# Altium project Dr_0n.PrjPcb
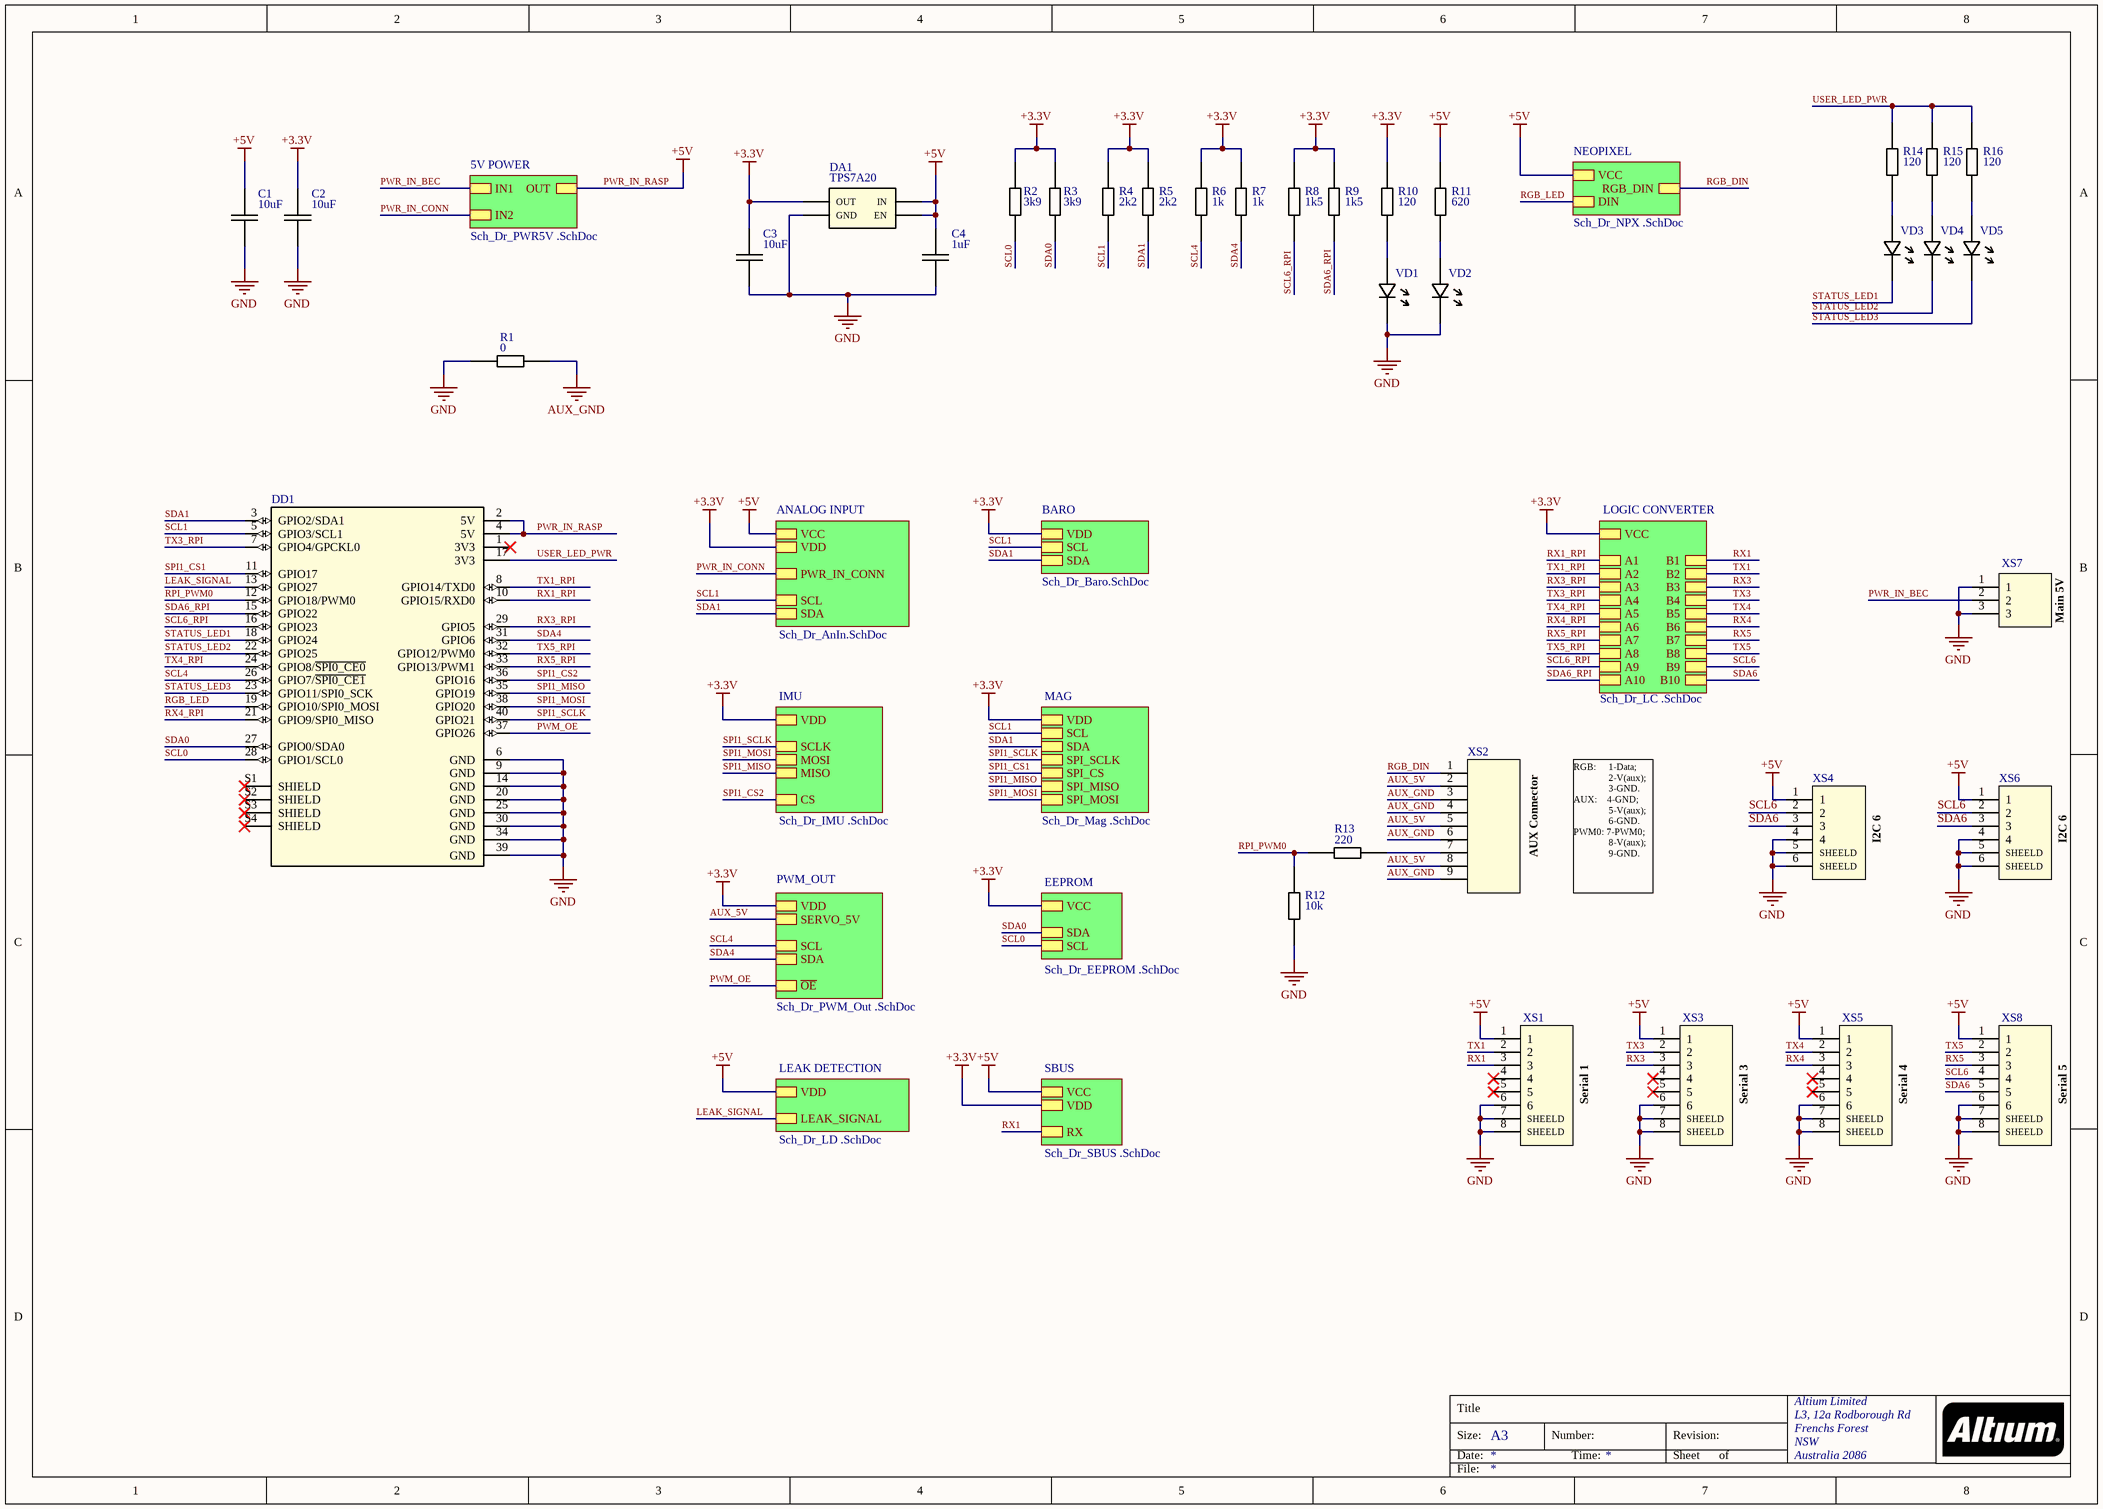
[diagram p0: Sch_Dr_General.SchDoc]
12 sheets, 162 parts. Net scope: hierarchical (ports join the sheet entries above them; power ports are global).
Board file: Dr_0n.PcbDoc
Sheets:
  Sch_Dr_General.SchDoc
    5V POWER = Sch_Dr_PWR5V .SchDoc
    BARO = Sch_Dr_Baro.SchDoc
    NEOPIXEL = Sch_Dr_NPX .SchDoc
    ANALOG INPUT = Sch_Dr_AnIn.SchDoc
    IMU = Sch_Dr_IMU .SchDoc
    MAG = Sch_Dr_Mag .SchDoc
    PWM_OUT = Sch_Dr_PWM_Out .SchDoc
    LEAK DETECTION = Sch_Dr_LD .SchDoc
    EEPROM = Sch_Dr_EEPROM .SchDoc
    SBUS = Sch_Dr_SBUS .SchDoc
    LOGIC CONVERTER = Sch_Dr_LC .SchDoc

## Sheet Sch_Dr_General.SchDoc
size A3; Organization: Altium Limited; Address1: L3, 12a Rodborough Rd; Address2: Frenchs Forest; Address3: NSW; Address4: Australia 2086

### Parts
C1  10uF  [Cap_0603]
C2  10uF  [Cap_0603]
C3  10uF  [Cap_0603]
C4  1uF  [Cap_0603]
DA1  TPS7A20  [SOT-23-5]
DD1  RASPBERRY_PI_4  [MOD_RASPBERRY_PI_4B_4GB]  (value not drawn)
R1  0  [Res_0603]
R2  3k9  [Res_0603]
R3  3k9  [Res_0603]
R4  2k2  [Res_0603]
R5  2k2  [Res_0603]
R6  1k  [Res_0603]
R7  1k  [Res_0603]
R8  1k5  [Res_0603]
R9  1k5  [Res_0603]
R10  120  [Res_0603]
R11  620  [Res_0603]
R12  10k  [Res_0603]
R13  220  [Res_0603]
R14  120  [Res_0603]
R15  120  [Res_0603]
R16  120  [Res_0603]
VD1  TO-1608BC-PG  [0603_LED]  (value not drawn)
VD2  TO-1608BC-PG  [0603_LED]  (value not drawn)
VD3  TO-1608BC-PG  [0603_LED]  (value not drawn)
VD4  TO-1608BC-PG  [0603_LED]  (value not drawn)
VD5  TO-1608BC-PG  [0603_LED]  (value not drawn)
XS1  BM06B-GHS-TBT(LF)(SN)(N)  [BM06B-GHS-TBT]  (value not drawn)
XS2  PLS-9  [AUX_CON]  (value not drawn)
XS3  BM06B-GHS-TBT(LF)(SN)(N)  [BM06B-GHS-TBT]  (value not drawn)
XS4  BM04B-GHS-TBT(LF)(SN)(N)  [BM04B-GHS-TBT]  (value not drawn)
XS5  BM06B-GHS-TBT(LF)(SN)(N)  [BM06B-GHS-TBT]  (value not drawn)
XS6  BM04B-GHS-TBT(LF)(SN)(N)  [BM04B-GHS-TBT]  (value not drawn)
XS7  PLS-3  [3X]  (value not drawn)
XS8  BM06B-GHS-TBT(LF)(SN)(N)  [BM06B-GHS-TBT]  (value not drawn)

### Sub-sheets
5V POWER = Sch_Dr_PWR5V .SchDoc: OUT, IN2, IN1
ANALOG INPUT = Sch_Dr_AnIn.SchDoc: VCC, VDD, PWR_IN_CONN, SCL, SDA
BARO = Sch_Dr_Baro.SchDoc: VDD, SCL, SDA
EEPROM = Sch_Dr_EEPROM .SchDoc: VCC, SDA, SCL
IMU = Sch_Dr_IMU .SchDoc: VDD, SCLK, MOSI, MISO, CS
LEAK DETECTION = Sch_Dr_LD .SchDoc: VDD, LEAK_SIGNAL
LOGIC CONVERTER = Sch_Dr_LC .SchDoc: A1, A2, A3, A4, A5, A6, A7, A8, A9, A10, B1, B2, B3, B4, B5, B6, B7, B8, B9, B10, VCC
MAG = Sch_Dr_Mag .SchDoc: VDD, SCL, SDA, SPI_SCLK, SPI_CS, SPI_MISO, SPI_MOSI
NEOPIXEL = Sch_Dr_NPX .SchDoc: VCC, DIN, RGB_DIN
PWM_OUT = Sch_Dr_PWM_Out .SchDoc: SERVO_5V, SCL, SDA, ~{OE}, VDD
SBUS = Sch_Dr_SBUS .SchDoc: VCC, VDD, RX

### Nets
+3.3V: C2.2 C3.2 DA1.5(OUT) R2.2 R3.2 R4.1 R5.1 R6.1 R7.1 R8.1 R9.1 R10.1 ; sheet BARO/VDD, sheet ANALOG INPUT/VDD, sheet IMU/VDD, sheet MAG/VDD, sheet PWM_OUT/VDD, sheet EEPROM/VCC, sheet SBUS/VDD, sheet LOGIC CONVERTER/VCC  [project net VCC]
AUX_GND: R1.2 XS2.3 XS2.4 XS2.6 XS2.9
GND: C1.1 C2.1 C3.1 C4.1 DA1.2(GND) DD1.6(GND) DD1.9(GND) DD1.14(GND) DD1.20(GND) DD1.25(GND) DD1.30(GND) DD1.34(GND) DD1.39(GND) R1.1 R12.2 VD1.1(K) VD2.1(K) XS1.6 XS1.7(SHEELD) XS1.8(SHEELD) XS3.6 XS3.7(SHEELD) XS3.8(SHEELD) XS4.4 XS4.5(SHEELD) XS4.6(SHEELD) XS5.6 XS5.7(SHEELD) XS5.8(SHEELD) XS6.4 XS6.5(SHEELD) XS6.6(SHEELD) XS7.1 XS7.3 XS8.6 XS8.7(SHEELD) XS8.8(SHEELD)
PWR_IN_RASP: C1.2 C4.2 DA1.1(IN) DA1.3(EN) DD1.2(5V) DD1.4(5V) R11.1 XS1.1 XS3.1 XS4.1 XS5.1 XS6.1 XS8.1 ; sheet 5V POWER/OUT, sheet NEOPIXEL/VCC, sheet ANALOG INPUT/VCC, sheet LEAK DETECTION/VDD, sheet SBUS/VCC  [also labelled +5V]
AUX_5V: XS2.2 XS2.5 XS2.8 ; sheet PWM_OUT/SERVO_5V
LEAK_SIGNAL: DD1.13(GPIO27) ; sheet LEAK DETECTION/LEAK_SIGNAL
PWM_OE: DD1.37(GPIO26) ; sheet PWM_OUT/~{OE}
PWR_IN_BEC: XS7.2 ; sheet 5V POWER/IN1  [project net IN1]
PWR_IN_CONN: sheet 5V POWER/IN2, sheet ANALOG INPUT/PWR_IN_CONN  [project net IN2]
RGB_DIN: XS2.1 ; sheet NEOPIXEL/RGB_DIN
RGB_LED: DD1.19(GPIO10/SPI0_MOSI) ; sheet NEOPIXEL/DIN
RPI_PWM0: DD1.12(GPIO18/PWM0) R12.1 R13.1
RX1: XS1.3 ; sheet SBUS/RX, sheet LOGIC CONVERTER/B1
RX1_RPI: DD1.10(GPIO15/RXD0) ; sheet LOGIC CONVERTER/A1
RX3: XS3.3 ; sheet LOGIC CONVERTER/B3
RX3_RPI: DD1.29(GPIO5) ; sheet LOGIC CONVERTER/A3
RX4: XS5.3 ; sheet LOGIC CONVERTER/B6
RX4_RPI: DD1.21(GPIO9/SPI0_MISO) ; sheet LOGIC CONVERTER/A6
RX5: XS8.3 ; sheet LOGIC CONVERTER/B7
RX5_RPI: DD1.33(GPIO13/PWM1) ; sheet LOGIC CONVERTER/A7
SCL0: DD1.28(GPIO1/SCL0) R2.1 ; sheet EEPROM/SCL
SCL1: DD1.5(GPIO3/SCL1) R4.2 ; sheet BARO/SCL, sheet ANALOG INPUT/SCL, sheet MAG/SCL
SCL4: DD1.26(GPIO7/~{SPI0_CE1}) R6.2 ; sheet PWM_OUT/SCL
SCL6: XS4.2 XS6.2 XS8.4 ; sheet LOGIC CONVERTER/B9
SCL6_RPI: DD1.16(GPIO23) R8.2 ; sheet LOGIC CONVERTER/A9
SDA0: DD1.27(GPIO0/SDA0) R3.1 ; sheet EEPROM/SDA
SDA1: DD1.3(GPIO2/SDA1) R5.2 ; sheet BARO/SDA, sheet ANALOG INPUT/SDA, sheet MAG/SDA
SDA4: DD1.31(GPIO6) R7.2 ; sheet PWM_OUT/SDA
SDA6: XS4.3 XS6.3 XS8.5 ; sheet LOGIC CONVERTER/B10
SDA6_RPI: DD1.15(GPIO22) R9.2 ; sheet LOGIC CONVERTER/A10
SPI1_CS1: DD1.11(GPIO17) ; sheet MAG/SPI_CS
SPI1_CS2: DD1.36(GPIO16) ; sheet IMU/CS
SPI1_MISO: DD1.35(GPIO19) ; sheet IMU/MISO, sheet MAG/SPI_MISO
SPI1_MOSI: DD1.38(GPIO20) ; sheet IMU/MOSI, sheet MAG/SPI_MOSI
SPI1_SCLK: DD1.40(GPIO21) ; sheet IMU/SCLK, sheet MAG/SPI_SCLK
STATUS_LED1: DD1.18(GPIO24) VD3.1(K)
STATUS_LED2: DD1.22(GPIO25) VD4.1(K)
STATUS_LED3: DD1.23(GPIO11/SPI0_SCK) VD5.1(K)
TX1: XS1.2 ; sheet LOGIC CONVERTER/B2
TX1_RPI: DD1.8(GPIO14/TXD0) ; sheet LOGIC CONVERTER/A2
TX3: XS3.2 ; sheet LOGIC CONVERTER/B4
TX3_RPI: DD1.7(GPIO4/GPCKL0) ; sheet LOGIC CONVERTER/A4
TX4: XS5.2 ; sheet LOGIC CONVERTER/B5
TX4_RPI: DD1.24(GPIO8/~{SPI0_CE0}) ; sheet LOGIC CONVERTER/A5
TX5: XS8.2 ; sheet LOGIC CONVERTER/B8
TX5_RPI: DD1.32(GPIO12/PWM0) ; sheet LOGIC CONVERTER/A8
USER_LED_PWR: DD1.17(3V3) R14.1 R15.1 R16.1
NetR10_2: R10.2 VD1.2(A)
NetR11_2: R11.2 VD2.2(A)
NetR13_2: R13.2 XS2.7
NetR14_2: R14.2 VD3.2(A)
NetR15_2: R15.2 VD4.2(A)
NetR16_2: R16.2 VD5.2(A)

Not connected (* = marked no-connect by the designer): DD1 1(3V3)* S1(SHIELD)* S2(SHIELD)* S3(SHIELD)* S4(SHIELD)*; XS1 4* 5*; XS3 4* 5*; XS5 4* 5*

### Notes on the sheet
- Main 5V
- AUX Connector
- I2C 6
- RGB:     1-Data;
  2-V(aux);
  3-GND.
  AUX:    4-GND;
  5-V(aux);
  6-GND.
  PWM0: 7-PWM0;
  8-V(aux);
  9-GND.
- Serial 1
- Serial 3
- Serial 4
- Serial 5
- Title
- Size:
- Date:
- A3
- Number:
- Time:
- Revision:
- Sheet
- of
- File:

### Library data of the parts
C1-C3 = Cap_: CC0603KRX5R7BB106
C4 = Cap_: CC0603JRX7R7BB105
DA1 = TPS7A20: High PSRR LDO
DD1 = RASPBERRY_PI_4B_4GB: BCM2711 Raspberry Pi 4 Model B 4GB - ARMÂ® CortexÂ®-A72 MPU Embedded Evaluation Board; MP: RASPBERRY PI 4B/4GB; Price: None; MF: Raspberry Pi; Check_prices: https://www.snapeda.com/parts/RASPBERRY%20PI%204B/4GB/Raspberry+Pi/view-part/?ref=eda; Value: *; Purchase-URL: https://pricing.snapeda.com/search/part/RASPBERRY PI 4B/4GB/?ref=eda; Availability: In Stock; SnapEDA_Link: https://www.snapeda.com/parts/RASPBERRY%20PI%204B/4GB/Raspberry+Pi/view-part/?ref=snap; Package: None
R1 = Res_: CR-03FL7----0R
R2 R3 = Res_: CR-03FL7---3K9
R4 R5 = Res_: CR-03FL7---2K2
R6 R7 = Res_: CR-03FL7----1K
R8 R9 = Res_: CR-03FL7---1K5
R10 R14 R16 = Res_: CR-03FL7--120R
R11 = Res_: CR-03FL7--620R
R12 = Res_: CR-03FL7---10K
R13 = Res_: CR-03FL7--220R
R15 = Res_: CR-03FL7---120R
VD1-VD5 = LED_: SMD LED Green
XS2 = AUX_CON

## Sheet Sch_Dr_PWR5V .SchDoc
size A4; Author: Noname; Organization: SpecGroup; Address3: ULY; Revision: Ver.1.0
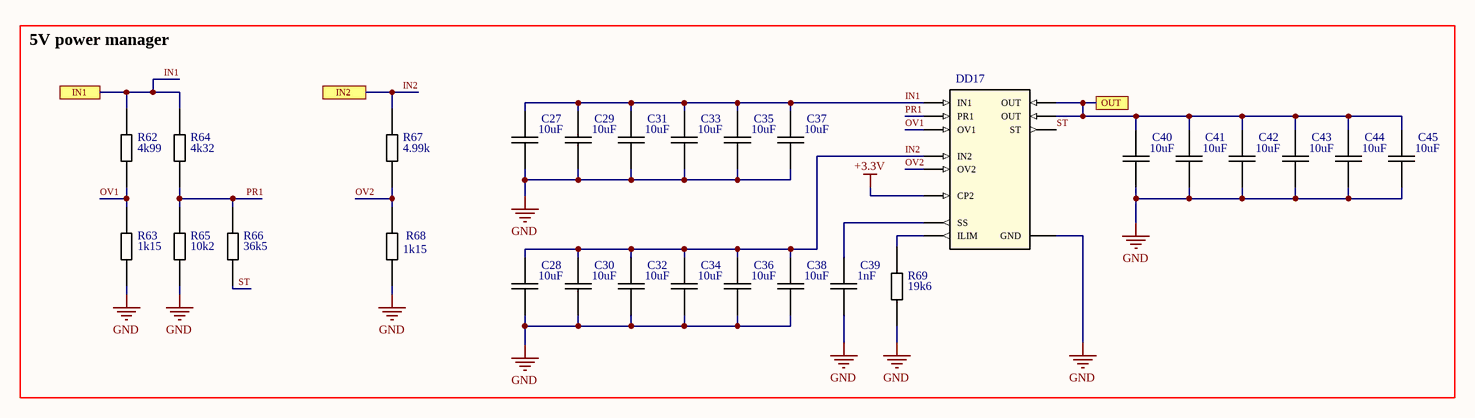
[diagram p1: Sch_Dr_PWR5V .SchDoc]

### Parts
C27  10uF  [Cap_0603]
C28  10uF  [Cap_0603]
C29  10uF  [Cap_0603]
C30  10uF  [Cap_0603]
C31  10uF  [Cap_0603]
C32  10uF  [Cap_0603]
C33  10uF  [Cap_0603]
C34  10uF  [Cap_0603]
C35  10uF  [Cap_0603]
C36  10uF  [Cap_0603]
C37  10uF  [Cap_0603]
C38  10uF  [Cap_0603]
C39  1nF  [Cap_0603]
C40  10uF  [Cap_0603]
C41  10uF  [Cap_0603]
C42  10uF  [Cap_0603]
C43  10uF  [Cap_0603]
C44  10uF  [Cap_0603]
C45  10uF  [Cap_0603]
DD17  TPS2121RUXR  [12-pin VQFN-HR]  (value not drawn)
R62  4k99  [Res_0603]
R63  1k15  [Res_0603]
R64  4k32  [Res_0603]
R65  10k2  [Res_0603]
R66  36k5  [Res_0603]
R67  4.99k  [Res_0603]
R68  1k15  [Res_0603]
R69  19k6  [Res_0603]

### Blocks framed on the sheet
5V power manager: C27-C45 DD17 R62-R69

### Ports
IN1, IN2, OUT

### Nets
+3.3V: DD17.3(CP2)  [project net VCC]
GND: C27.1 C28.1 C29.1 C30.1 C31.1 C32.1 C33.1 C34.1 C35.1 C36.1 C37.1 C38.1 C39.1 C40.1 C41.1 C42.1 C43.1 C44.1 C45.1 DD17.12(GND) R63.2 R65.2 R68.2 R69.2
PWR_IN_RASP: C40.2 C41.2 C42.2 C43.2 C44.2 C45.2 DD17.1(OUT) DD17.8(OUT) ; port OUT
IN1: C27.2 C29.2 C31.2 C33.2 C35.2 C37.2 DD17.7(IN1) R62.1 R64.1 ; port IN1
IN2: C28.2 C30.2 C32.2 C34.2 C36.2 C38.2 DD17.2(IN2) R67.1 ; port IN2
OV1: DD17.5(OV1) R62.2 R63.1
OV2: DD17.4(OV2) R67.2 R68.1
PR1: DD17.6(PR1) R64.2 R65.1 R66.1
ST: DD17.9(ST) R66.2
NetC39_2: C39.2 DD17.11(SS)
NetDD17_10: DD17.10(ILIM) R69.1

### Notes on the sheet
- Title
- Size:
- Date:
- A4
- Number:
- Time:
- Revision:
- Sheet
- of
- File:

### Library data of the parts
C27-C38 C40-C45 = Cap_: CC0603KRX5R7BB106
C39 = Cap_: CC0603JRX7R9BB102
DD17 = TPS2121RUXR: 2.8V to 22V Priority Power MUX with Seamless Switchover
R62 R67 = Res_: RC0603FR-074K99L
R63 R68 = Res_: RC0603FR-071K15L
R64 = Res_: RC0603FR-074K32L
R65 = Res_: RC0603FR-0710K2L
R66 = Res_: RC0603FR-0736K5L
R69 = Res_: RC0603FR-0719K6L

## Sheet Sch_Dr_Baro.SchDoc
size A4 portrait; Organization: Altium Limited; Address1: L3, 12a Rodborough Rd; Address2: Frenchs Forest; Address3: NSW; Address4: Australia 2086
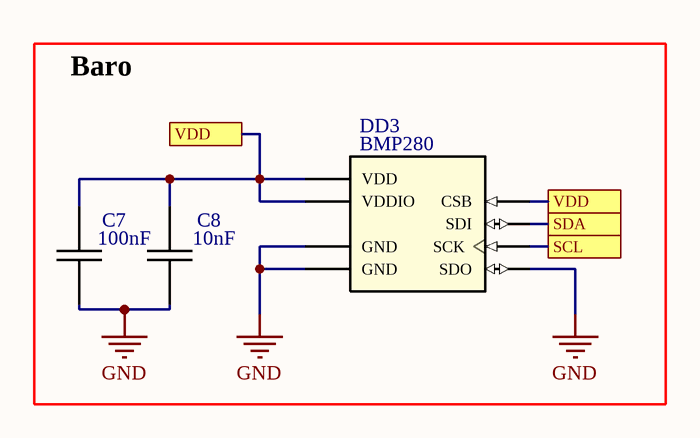
[diagram p2: Sch_Dr_Baro.SchDoc]

### Parts
C7  100nF  [Cap_0603]
C8  10nF  [Cap_0603]
DD3  BMP280  [8-pin metal-lid LGA 2.0*2.5*0.95]

### Blocks framed on the sheet
Baro: C7 C8 DD3

### Ports
SCL, SDA, VDD

### Nets
GND: C7.1 C8.1 DD3.1(GND) DD3.5(SDO) DD3.7(GND)
VCC: C7.2 C8.2 DD3.2(CSB) DD3.6(VDDIO) DD3.8(VDD) ; port VDD
SCL1: DD3.4(SCK) ; port SCL
SDA1: DD3.3(SDI) ; port SDA

### Notes on the sheet
- Title
- Size:
- Date:
- A4
- Number:
- Time:
- Revision:
- Sheet
- of
- File:

### Library data of the parts
C7 = Cap_: CC0603JRX7R8BB104
C8 = Cap_: CC0603JRNPO9BN103
DD3 = BMP280: BMP280 Absolute Barometric Pressure Sensor for Battery Powered Devices 2 x 2.5mm

## Sheet Sch_Dr_NPX .SchDoc
size A4 portrait; Author: Noname; Address3: ULY; Revision: Ver.1.0
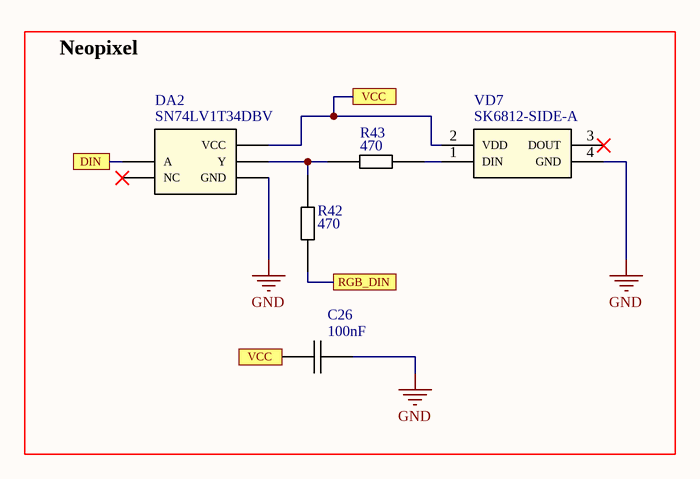
[diagram p3: Sch_Dr_NPX .SchDoc]

### Parts
C26  100nF  [Cap_0603]
DA2  SN74LV1T34DBV  [SOT-23-5]
R42  470  [Res_0603]
R43  470  [Res_0603]
VD7  SK6812-SIDE-A  [SK6812 (LED)]

### Blocks framed on the sheet
Neopixel: C26 DA2 R42 R43 VD7

### Ports
DIN, RGB_DIN, VCC

### Nets
GND: C26.2 DA2.3(GND) VD7.4(GND)
PWR_IN_RASP: C26.1 DA2.5(VCC) VD7.2(VDD) ; port VCC
RGB_DIN: R42.1 ; port RGB_DIN
RGB_LED: DA2.2(A) ; port DIN
NetDA2_4: DA2.4(Y) R42.2 R43.1
NetR43_2: R43.2 VD7.1(DIN)

Not connected (* = marked no-connect by the designer): DA2 1(NC)*; VD7 3(DOUT)*

### Notes on the sheet
- Title
- Size:
- Date:
- A4
- Number:
- Time:
- Revision:
- Sheet
- of
- File:

### Library data of the parts
C26 = Cap_: CC0603JRX7R8BB104
DA2 = SN74LV1T34DBV: Single Power Supply Single Buffer GATE CMOS Logic Level Sgifter
R42 R43 = Res_: CR-03FL7--470R
VD7 = SK6812-SIDE-A: LED chip

## Sheet Sch_Dr_AnIn.SchDoc
size A4; Author: Noname; CompanyName: Spec Company; Address3: ULY; Revision: ver.1.0
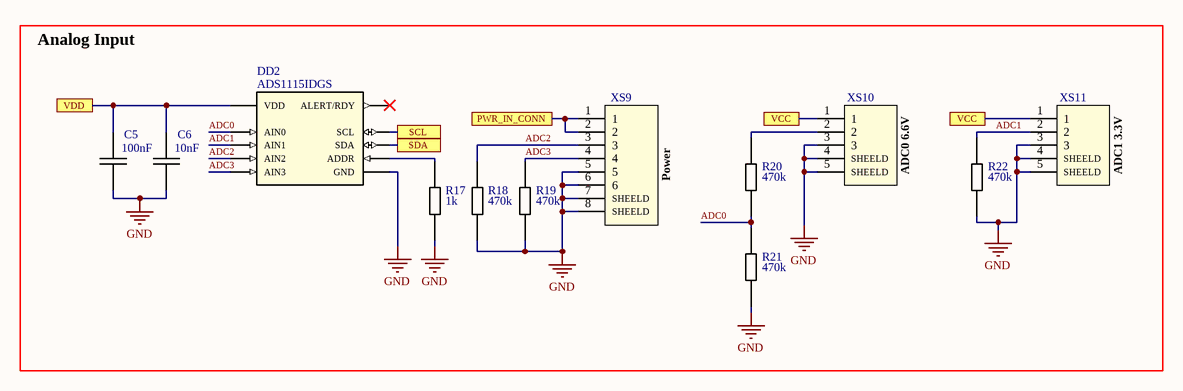
[diagram p4: Sch_Dr_AnIn.SchDoc]

### Parts
C5  100nF  [Cap_0603]
C6  10nF  [Cap_0603]
DD2  ADS1115IDGS  [MSOP-10]
R17  1k  [Res_0603]
R18  470k  [Res_0603]
R19  470k  [Res_0603]
R20  470k  [Res_0603]
R21  470k  [Res_0603]
R22  470k  [Res_0603]
XS9  BM06B-GHS-TBT(LF)(SN)(N)  [BM06B-GHS-TBT]  (value not drawn)
XS10  BM03B-GHS-TBT  [BM03B-GHS-TBT]  (value not drawn)
XS11  BM03B-GHS-TBT  [BM03B-GHS-TBT]  (value not drawn)

### Ports
PWR_IN_CONN, SCL, SDA, VCC, VDD

### Nets
GND: C5.1 C6.1 DD2.3(GND) R17.2 R18.2 R19.2 R21.2 R22.2 XS9.5 XS9.6 XS9.7(SHEELD) XS9.8(SHEELD) XS10.3 XS10.4(SHEELD) XS10.5(SHEELD) XS11.3 XS11.4(SHEELD) XS11.5(SHEELD)
PWR_IN_RASP: XS10.1 XS11.1 ; port VCC
VCC: C5.2 C6.2 DD2.8(VDD) ; port VDD
ADC0: DD2.4(AIN0) R20.2 R21.1
ADC1: DD2.5(AIN1) R22.1 XS11.2
ADC2: DD2.6(AIN2) R18.1 XS9.3
ADC3: DD2.7(AIN3) R19.1 XS9.4
IN2: XS9.1 XS9.2 ; port PWR_IN_CONN
SCL1: DD2.10(SCL) ; port SCL
SDA1: DD2.9(SDA) ; port SDA
NetDD2_1: DD2.1(ADDR) R17.1
NetR20_1: R20.1 XS10.2

Not connected (* = marked no-connect by the designer): DD2 2(ALERT/RDY)*

### Notes on the sheet
- Analog Input
- ADC0 6.6V
- ADC1 3.3V
- Power
- Title
- Size:
- Date:
- A4
- Number:
- Time:
- Revision:
- Sheet
- of
- File:

### Library data of the parts
C5 = Cap_: CC0603JRX7R8BB104
C6 = Cap_: CC0603JRNPO9BN103
DD2 = ADS1115IDGS: Ultra-Small, Low-Power, 16-Bit, ADC with Internal Reference, 4-channel
R17 = Res_: CR-03FL7----1K
R18-R22 = Res_: CR-03FL7--470K

## Sheet Sch_Dr_IMU .SchDoc
size A4 portrait; Organization: Altium Limited; Address1: L3, 12a Rodborough Rd; Address2: Frenchs Forest; Address3: NSW; Address4: Australia 2086
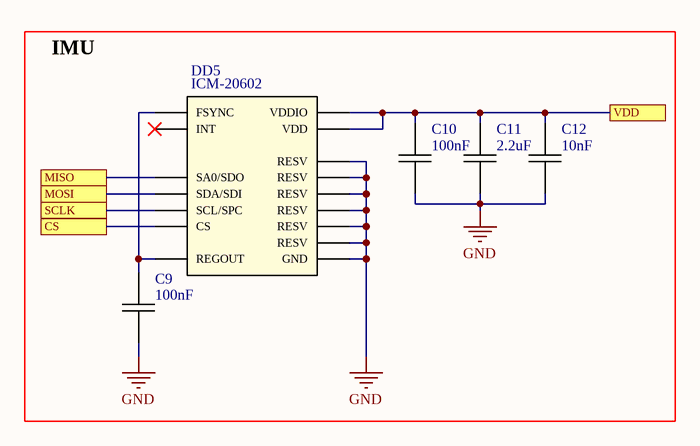
[diagram p5: Sch_Dr_IMU .SchDoc]

### Parts
C9  100nF  [Cap_0603]
C10  100nF  [Cap_0603]
C11  2.2uF  [Cap_0603]
C12  10nF  [Cap_0603]
DD5  ICM-20602  [16-pin LGA]

### Blocks framed on the sheet
IMU: C9-C12 DD5

### Ports
CS, MISO, MOSI, SCLK, VDD

### Nets
GND: C9.2 C10.2 C11.2 C12.2 DD5.7(RESV) DD5.9(RESV) DD5.10(RESV) DD5.11(RESV) DD5.12(RESV) DD5.13(GND) DD5.15(RESV)
VCC: C10.1 C11.1 C12.1 DD5.1(VDDIO) DD5.16(VDD) ; port VDD
SPI1_CS2: DD5.5(CS) ; port CS
SPI1_MISO: DD5.4(SA0/SDO) ; port MISO
SPI1_MOSI: DD5.3(SDA/SDI) ; port MOSI
SPI1_SCLK: DD5.2(SCL/SPC) ; port SCLK
NetC9_1: C9.1 DD5.8(FSYNC) DD5.14(REGOUT)

Not connected (* = marked no-connect by the designer): DD5 6(INT)*

### Notes on the sheet
- Title
- Size:
- Date:
- A4
- Number:
- Time:
- Revision:
- Sheet
- of
- File:

### Library data of the parts
C9 C10 = Cap_: CC0603JRX7R8BB104
C11 = Cap_: CC0603KRX5R7BB225
C12 = Cap_: CC0603JRNPO9BN103
DD5 = ICM-20602: 6-axis MotionTracking device. / 3-axis gyroscope, 3-axis accelerometer

## Sheet Sch_Dr_Mag .SchDoc
size A4 portrait
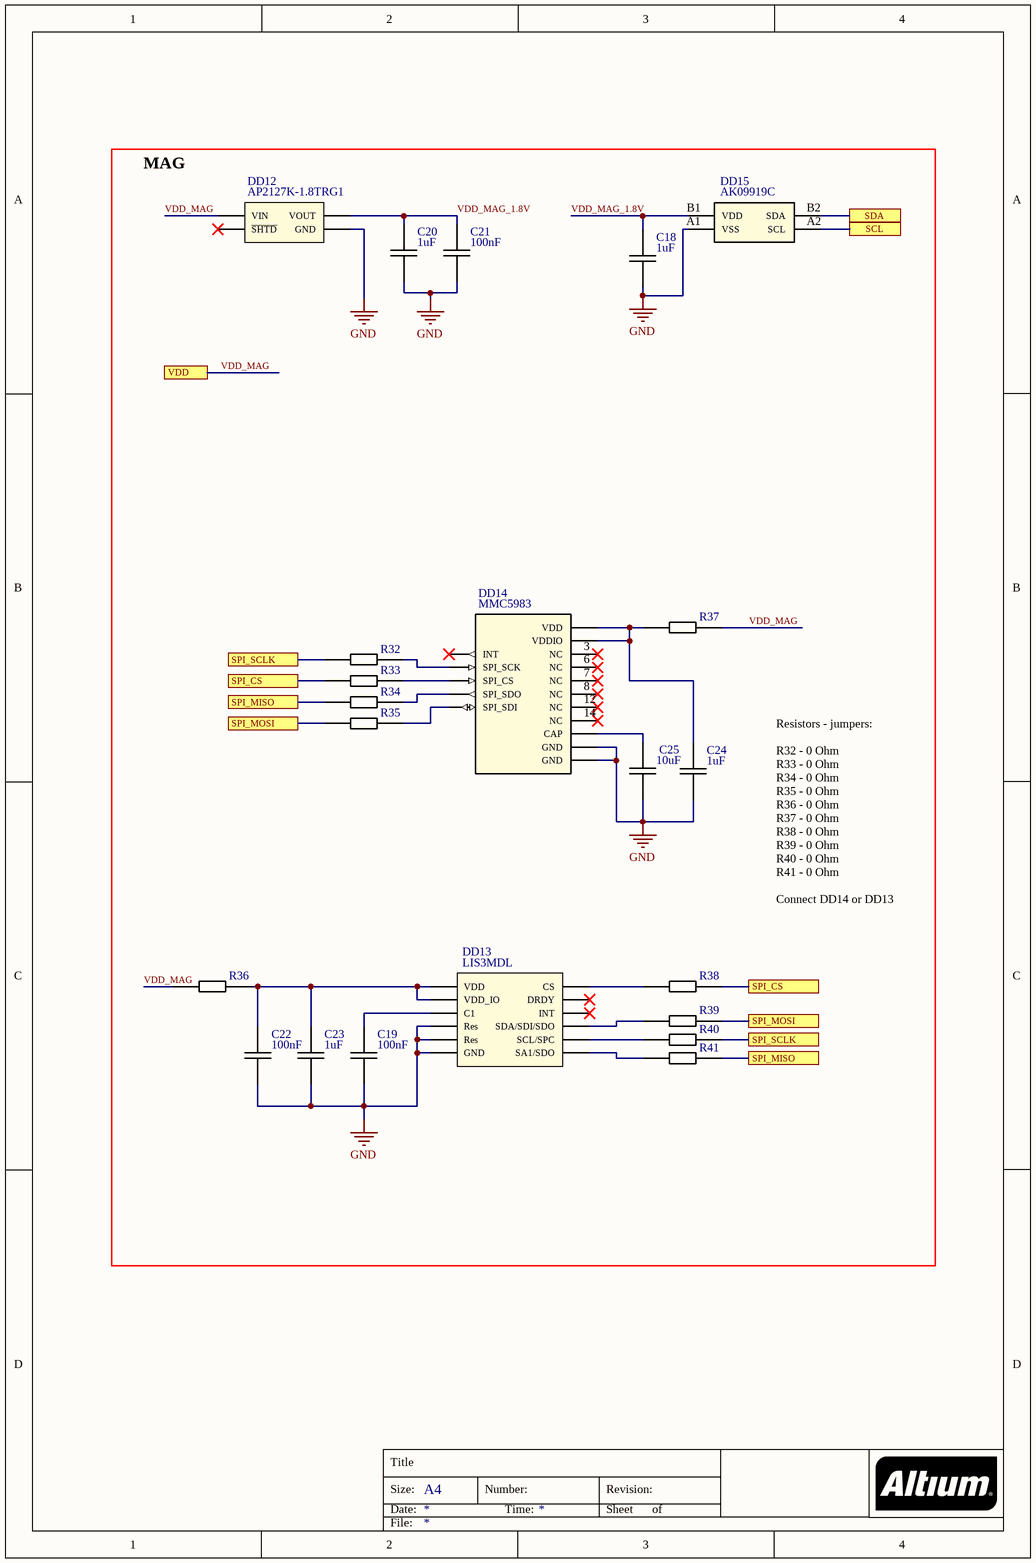
[diagram p6: Sch_Dr_Mag .SchDoc]

### Parts
C18  1uF  [Cap_0603]
C19  100nF  [Cap_0603]
C20  1uF  [Cap_0603]
C21  100nF  [Cap_0603]
C22  100nF  [Cap_0603]
C23  1uF  [Cap_0603]
C24  1uF  [Cap_0603]
C25  10uF  [Cap_0603]
DD12  AP2127K-1.8TRG1  [SOT-23-5]
DD13  LIS3MDL  [LGA-12]
DD14  MMC5983  [LGA-16]
DD15  AK09919C  [AK09916]
R32  0  [Res_0402]  (value not drawn)
R33  0  [Res_0402]  (value not drawn)
R34  0  [Res_0402]  (value not drawn)
R35  0  [Res_0402]  (value not drawn)
R36  0  [Res_0402]  (value not drawn)
R37  0  [Res_0402]  (value not drawn)
R38  0  [Res_0402]  (value not drawn)
R39  0  [Res_0402]  (value not drawn)
R40  0  [Res_0402]  (value not drawn)
R41  0  [Res_0402]  (value not drawn)

### Blocks framed on the sheet
MAG: C18-C25 DD12-DD15 R32-R41

### Ports
SCL, SDA, SPI_CS, SPI_MISO, SPI_MOSI, SPI_SCLK, VDD

### Nets
GND: C18.1 C19.1 C20.1 C21.1 C22.1 C23.1 C24.1 C25.1 DD12.2(GND) DD13.2(Res) DD13.3(GND) DD13.12(Res) DD14.9(GND) DD14.11(GND) DD15.A1(VSS)
VDD_MAG: DD12.1(VIN) R36.1 R37.2 ; port VDD  [project net VCC]
SCL1: DD15.A2(SCL) ; port SCL
SDA1: DD15.B2(SDA) ; port SDA
SPI1_CS1: R33.1 R38.2 ; port SPI_CS
SPI1_MISO: R34.1 R41.2 ; port SPI_MISO
SPI1_MOSI: R35.1 R39.2 ; port SPI_MOSI
SPI1_SCLK: R32.1 R40.2 ; port SPI_SCLK
VDD_MAG_1.8V: C18.2 C20.2 C21.2 DD12.5(VOUT) DD15.B1(VDD)
NetC19_2: C19.2 DD13.4(C1)
NetC22_2: C22.2 C23.2 DD13.5(VDD) DD13.6(VDD_IO) R36.2
NetC24_2: C24.2 DD14.2(VDD) DD14.13(VDDIO) R37.1
NetC25_2: C25.2 DD14.10(CAP)
NetDD13_1: DD13.1(SCL/SPC) R40.1
NetDD13_9: DD13.9(SA1/SDO) R41.1
NetDD13_10: DD13.10(CS) R38.1
NetDD13_11: DD13.11(SDA/SDI/SDO) R39.1
NetDD14_1: DD14.1(SPI_SCK) R32.2
NetDD14_4: DD14.4(SPI_CS) R33.2
NetDD14_5: DD14.5(SPI_SDO) R34.2
NetDD14_16: DD14.16(SPI_SDI) R35.2

Not connected (* = marked no-connect by the designer): DD12 3(~{SHTD})*; DD13 7(INT)* 8(DRDY)*; DD14 3(NC)* 6(NC)* 7(NC)* 8(NC)* 12(NC)* 14(NC)* 15(INT)*

### Notes on the sheet
- Resistors - jumpers:
  R32 - 0 Ohm
  R33 - 0 Ohm
  R34 - 0 Ohm
  R35 - 0 Ohm
  R36 - 0 Ohm
  R37 - 0 Ohm
  R38 - 0 Ohm
  R39 - 0 Ohm
  R40 - 0 Ohm
  R41 - 0 Ohm
  Connect DD14 or DD13
- Title
- Size:
- Date:
- A4
- Number:
- Time:
- Revision:
- Sheet
- of
- File:

### Library data of the parts
C18 C20 C23 C24 = Cap_: CC0603JRX7R7BB105
C19 C21 C22 = Cap_: CC0603JRX7R8BB104
C25 = Cap_: CC0603KRX5R7BB106
DD12 = AP2127K-1.8TRG1: 300mA High Speed, Extremely low noise CMOS LDO regulator
DD13 = LIS3MDL: Ultra-low power, high-perfomance 3-axis magnetometer.
DD14 = MMC5983: 3-axis Magnetic Sensor
DD15 = AK09919C: 3-axis Electronic Compass, 1.8V.
R32-R41 = Res_: RC0402FR-070RL

## Sheet Sch_Dr_PWM_Out .SchDoc
size A4; Organization: Altium Limited; Address1: L3, 12a Rodborough Rd; Address2: Frenchs Forest; Address3: NSW; Address4: Australia 2086
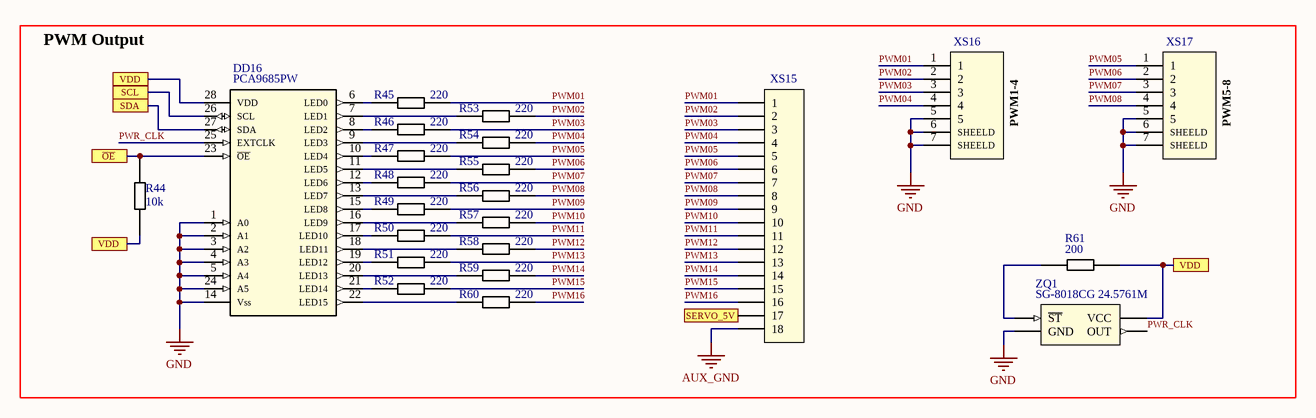
[diagram p7: Sch_Dr_PWM_Out .SchDoc]

### Parts
DD16  PCA9685PW  [TSSOP28]
R44  10k  [Res_0603]
R45  220  [Res_0603]
R46  220  [Res_0603]
R47  220  [Res_0603]
R48  220  [Res_0603]
R49  220  [Res_0603]
R50  220  [Res_0603]
R51  220  [Res_0603]
R52  220  [Res_0603]
R53  220  [Res_0603]
R54  220  [Res_0603]
R55  220  [Res_0603]
R56  220  [Res_0603]
R57  220  [Res_0603]
R58  220  [Res_0603]
R59  220  [Res_0603]
R60  220  [Res_0603]
R61  200  [Res_0603]
XS15  Servo16x  [Servo16x]  (value not drawn)
XS16  BM05B-GHS-TBT(LF)(SN)(N)  [BM05B-GHS-TBT]  (value not drawn)
XS17  BM05B-GHS-TBT(LF)(SN)(N)  [BM05B-GHS-TBT]  (value not drawn)
ZQ1  SG-8018CG 24.5761M  [SG-8018CG 24.5761M-TJHSA0]

### Ports
SCL, SDA, SERVO_5V, VDD, ~{OE}

### Nets
AUX_GND: XS15.18
GND: DD16.1(A0) DD16.2(A1) DD16.3(A2) DD16.4(A3) DD16.5(A4) DD16.14(Vss) DD16.24(A5) XS16.5 XS16.6(SHEELD) XS16.7(SHEELD) XS17.5 XS17.6(SHEELD) XS17.7(SHEELD) ZQ1.2(GND)
VCC: DD16.28(VDD) R44.1 R61.2 ZQ1.4(VCC) ; port VDD
AUX_5V: XS15.17 ; port SERVO_5V
PWM01: R45.2 XS15.1 XS16.1
PWM02: R53.2 XS15.2 XS16.2
PWM03: R46.2 XS15.3 XS16.3
PWM04: R54.2 XS15.4 XS16.4
PWM05: R47.2 XS15.5 XS17.1
PWM06: R55.2 XS15.6 XS17.2
PWM07: R48.2 XS15.7 XS17.3
PWM08: R56.2 XS15.8 XS17.4
PWM09: R49.2 XS15.9
PWM10: R57.2 XS15.10
PWM11: R50.2 XS15.11
PWM12: R58.2 XS15.12
PWM13: R51.2 XS15.13
PWM14: R59.2 XS15.14
PWM15: R52.2 XS15.15
PWM16: R60.2 XS15.16
PWM_OE: DD16.23(~{OE}) R44.2 ; port ~{OE}
PWR_CLK: DD16.25(EXTCLK) ZQ1.3(OUT)
SCL4: DD16.26(SCL) ; port SCL
SDA4: DD16.27(SDA) ; port SDA
NetDD16_6: DD16.6(LED0) R45.1
NetDD16_7: DD16.7(LED1) R53.1
NetDD16_8: DD16.8(LED2) R46.1
NetDD16_9: DD16.9(LED3) R54.1
NetDD16_10: DD16.10(LED4) R47.1
NetDD16_11: DD16.11(LED5) R55.1
NetDD16_12: DD16.12(LED6) R48.1
NetDD16_13: DD16.13(LED7) R56.1
NetDD16_15: DD16.15(LED8) R49.1
NetDD16_16: DD16.16(LED9) R57.1
NetDD16_17: DD16.17(LED10) R50.1
NetDD16_18: DD16.18(LED11) R58.1
NetDD16_19: DD16.19(LED12) R51.1
NetDD16_20: DD16.20(LED13) R59.1
NetDD16_21: DD16.21(LED14) R52.1
NetDD16_22: DD16.22(LED15) R60.1
NetR61_1: R61.1 ZQ1.1(~{ST})

### Notes on the sheet
- PWM Output
- PWM1-4
- PWM5-8
- Title
- Size:
- Date:
- A4
- Number:
- Time:
- Revision:
- Sheet
- of
- File:

### Library data of the parts
DD16 = PCA9685PW: 16-ch, 12-bit PWM Fm+ I2C-bus LED controller
R44 = Res_: CR-03FL7---10K
R45-R60 = Res_: CR-03FL7--220R
R61 = Res_: CR-03FL7--200R
XS15 = Servo16x: 16*3
ZQ1 = SG-8018CG 24.5761M: Crystal Oscillator 24.576MHz

## Sheet Sch_Dr_LD .SchDoc
size A4 portrait; Address3: ULY
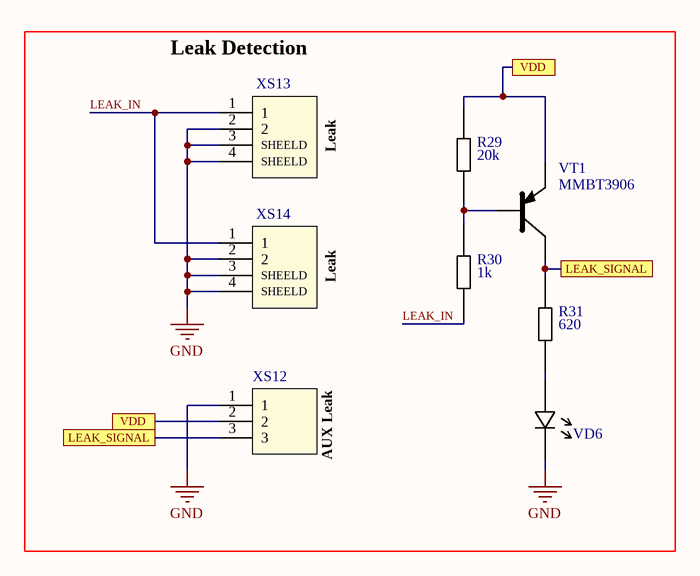
[diagram p8: Sch_Dr_LD .SchDoc]

### Parts
R29  20k  [Res_0603]
R30  1k  [Res_0603]
R31  620  [Res_0603]
VD6  TO-1608BC-PG  [0603_LED]  (value not drawn)
VT1  MMBT3906  [SOT-23-3]
XS12  PLS-3  [3X]  (value not drawn)
XS13  BM02B-GHS-TBT(LF)(SN)(N)  [BM02B-GHS-TBT]  (value not drawn)
XS14  BM02B-GHS-TBT(LF)(SN)(N)  [BM02B-GHS-TBT]  (value not drawn)

### Ports
LEAK_SIGNAL, VDD

### Nets
GND: VD6.1(K) XS12.1 XS13.2 XS13.3(SHEELD) XS13.4(SHEELD) XS14.2 XS14.3(SHEELD) XS14.4(SHEELD)
PWR_IN_RASP: R29.1 VT1.2(E) XS12.2 ; port VDD
LEAK_IN: R30.2 XS13.1 XS14.1
LEAK_SIGNAL: R31.1 VT1.3(C) XS12.3 ; port LEAK_SIGNAL
NetR29_2: R29.2 R30.1 VT1.1(B)
NetR31_2: R31.2 VD6.2(A)

### Notes on the sheet
- (near XS13) Leak Detection
- Leak
- AUX Leak
- Title
- Size:
- Date:
- A4
- Number:
- Time:
- Revision:
- Sheet
- of
- File:

### Library data of the parts
R29 = Res_: CR-03FL7---20K
R30 = Res_: CR-03FL7----1K
R31 = Res_: CR-03FL7--620R
VD6 = LED_: SMD LED Green
VT1 = MMBT3906: SOT-23, 40V, 0.2A, NPN Bipolar Transistor

## Sheet Sch_Dr_EEPROM .SchDoc
size A4 portrait; Author: Noname; CompanyName: Spec Company; Address3: ULY
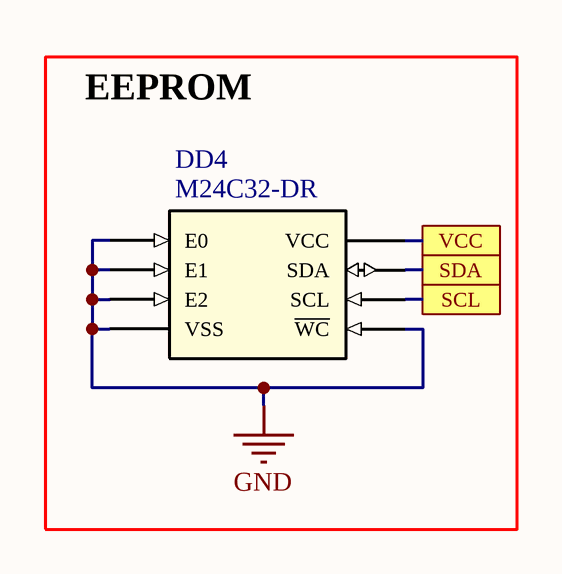
[diagram p9: Sch_Dr_EEPROM .SchDoc]

### Parts
DD4  M24C32-DR  [TSSOP-8]

### Blocks framed on the sheet
EEPROM: DD4

### Ports
SCL, SDA, VCC

### Nets
GND: DD4.1(E0) DD4.2(E1) DD4.3(E2) DD4.4(VSS) DD4.7(~{WC})
VCC: DD4.8(VCC) ; port VCC
SCL0: DD4.6(SCL) ; port SCL
SDA0: DD4.5(SDA) ; port SDA

### Notes on the sheet
- Title
- Size:
- Date:
- A4
- Number:
- Time:
- Revision:
- Sheet
- of
- File:

### Library data of the parts
DD4 = M24C32-DR: EEPROM Memory IC 32Kb (4K x 8) I²C 1 MHz 450 ns

## Sheet Sch_Dr_SBUS .SchDoc
size A4 portrait; Author: Noname; Organization: Spec Company; Address3: ULY; Revision: Ver.1.0
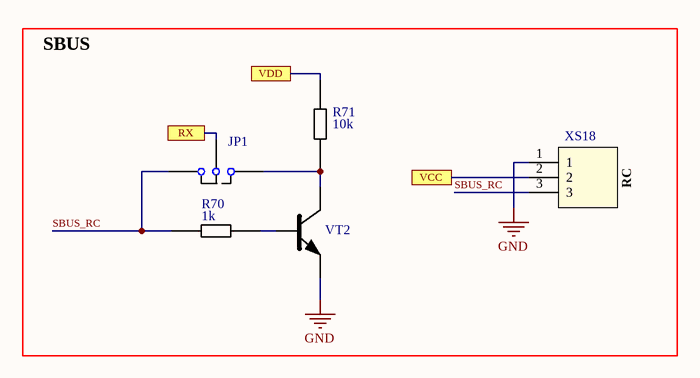
[diagram p10: Sch_Dr_SBUS .SchDoc]

### Parts
JP1  Jumper  [Jumper]  (value not drawn)
R70  1k  [Res_0603]
R71  10k  [Res_0603]
VT2  MMBT3904  [SOT-23-3]  (value not drawn)
XS18  PLS-3  [3X]  (value not drawn)

### Ports
RX, VCC, VDD

### Nets
GND: VT2.2(E) XS18.1
PWR_IN_RASP: XS18.2 ; port VCC
VCC: R71.1 ; port VDD
RX1: JP1.2 ; port RX
SBUS_RC: JP1.3 R70.1 XS18.3
NetJP1_1: JP1.1 R71.2 VT2.3(C)
NetR70_2: R70.2 VT2.1(B)

### Notes on the sheet
- SBUS
- RC
- Title
- Size:
- Date:
- A4
- Number:
- Time:
- Revision:
- Sheet
- of
- File:

### Library data of the parts
R70 = Res_: CR-03FL7----1K
R71 = Res_: CR-03FL7---10K
VT2 = MMBT3904: SOT-23, -40V, -0.2A, PNP Bipolar Transistor

## Sheet Sch_Dr_LC .SchDoc
size A4; Organization: Altium Limited; Address1: L3, 12a Rodborough Rd; Address2: Frenchs Forest; Address3: NSW; Address4: Australia 2086
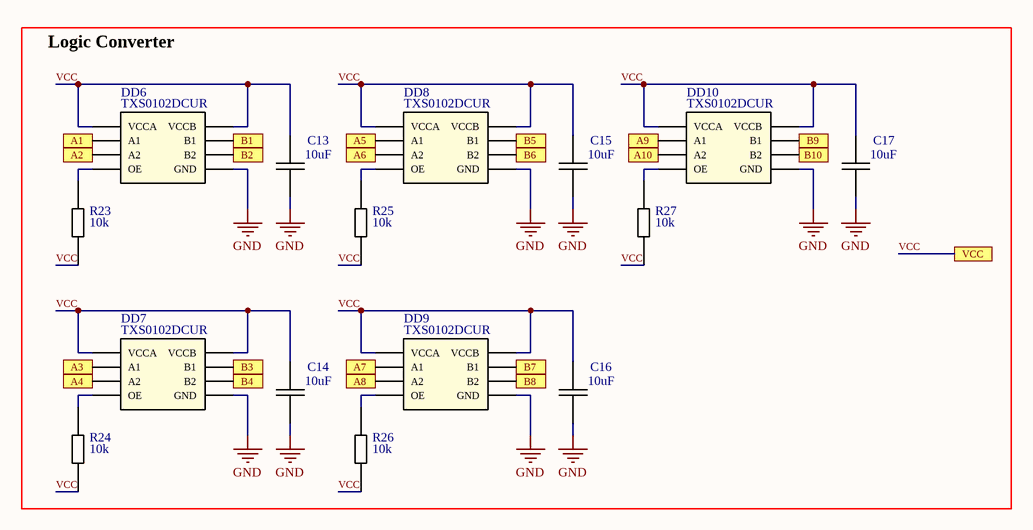
[diagram p11: Sch_Dr_LC .SchDoc]

### Parts
C13  10uF  [Cap_0603]
C14  10uF  [Cap_0603]
C15  10uF  [Cap_0603]
C16  10uF  [Cap_0603]
C17  10uF  [Cap_0603]
DD6  TXS0102DCUR  [VSSOP-8]
DD7  TXS0102DCUR  [VSSOP-8]
DD8  TXS0102DCUR  [VSSOP-8]
DD9  TXS0102DCUR  [VSSOP-8]
DD10  TXS0102DCUR  [VSSOP-8]
R23  10k  [Res_0603]
R24  10k  [Res_0603]
R25  10k  [Res_0603]
R26  10k  [Res_0603]
R27  10k  [Res_0603]

### Blocks framed on the sheet
Logic Converter: C13-C17 DD6-DD10 R23-R27

### Ports
A1, A2, A3, A4, A5, A6, A7, A8, A9, A10, B1, B2, B3, B4, B5, B6, B7, B8, B9, B10, VCC

### Nets
GND: C13.1 C14.1 C15.1 C16.1 C17.1 DD6.2(GND) DD7.2(GND) DD8.2(GND) DD9.2(GND) DD10.2(GND)
VCC: C13.2 C14.2 C15.2 C16.2 C17.2 DD6.3(VCCA) DD6.7(VCCB) DD7.3(VCCA) DD7.7(VCCB) DD8.3(VCCA) DD8.7(VCCB) DD9.3(VCCA) DD9.7(VCCB) DD10.3(VCCA) DD10.7(VCCB) R23.2 R24.2 R25.2 R26.2 R27.2 ; port VCC
RX1: DD6.8(B1) ; port B1
RX1_RPI: DD6.5(A1) ; port A1
RX3: DD7.8(B1) ; port B3
RX3_RPI: DD7.5(A1) ; port A3
RX4: DD8.1(B2) ; port B6
RX4_RPI: DD8.4(A2) ; port A6
RX5: DD9.8(B1) ; port B7
RX5_RPI: DD9.5(A1) ; port A7
SCL6: DD10.8(B1) ; port B9
SCL6_RPI: DD10.5(A1) ; port A9
SDA6: DD10.1(B2) ; port B10
SDA6_RPI: DD10.4(A2) ; port A10
TX1: DD6.1(B2) ; port B2
TX1_RPI: DD6.4(A2) ; port A2
TX3: DD7.1(B2) ; port B4
TX3_RPI: DD7.4(A2) ; port A4
TX4: DD8.8(B1) ; port B5
TX4_RPI: DD8.5(A1) ; port A5
TX5: DD9.1(B2) ; port B8
TX5_RPI: DD9.4(A2) ; port A8
NetDD6_6: DD6.6(OE) R23.1
NetDD7_6: DD7.6(OE) R24.1
NetDD8_6: DD8.6(OE) R25.1
NetDD9_6: DD9.6(OE) R26.1
NetDD10_6: DD10.6(OE) R27.1

### Notes on the sheet
- Title
- Size:
- Date:
- A4
- Number:
- Time:
- Revision:
- Sheet
- of
- File:

### Library data of the parts
C13-C17 = Cap_: CC0603KRX5R7BB106
DD6-DD10 = TXS0102YZ: 2-bit Bidirectional Voltage-level Translator for Open-Drain and Push-Pull Application
R23-R27 = Res_: CR-03FL7---10K

## Nets that join several sheets
AUX_GND: Sch_Dr_General (5 pins), Sch_Dr_PWM_Out  (XS15.18)
GND: Sch_Dr_General (37 pins), Sch_Dr_PWR5V  (24 pins), Sch_Dr_Baro (5 pins), Sch_Dr_NPX  (C26.2 DA2.3 VD7.4), Sch_Dr_AnIn (18 pins), Sch_Dr_IMU  (11 pins), Sch_Dr_Mag  (15 pins), Sch_Dr_PWM_Out  (14 pins), Sch_Dr_LD  (8 pins), Sch_Dr_EEPROM  (5 pins), Sch_Dr_SBUS  (VT2.2 XS18.1), Sch_Dr_LC  (10 pins)
PWR_IN_RASP: Sch_Dr_General (13 pins), Sch_Dr_PWR5V  (8 pins), Sch_Dr_NPX  (C26.1 DA2.5 VD7.2), Sch_Dr_AnIn (XS10.1 XS11.1), Sch_Dr_LD  (R29.1 VT1.2 XS12.2), Sch_Dr_SBUS  (XS18.2)
VCC: Sch_Dr_General (12 pins), Sch_Dr_PWR5V  (DD17.3), Sch_Dr_Baro (5 pins), Sch_Dr_AnIn (C5.2 C6.2 DD2.8), Sch_Dr_IMU  (5 pins), Sch_Dr_Mag  (DD12.1 R36.1 R37.2), Sch_Dr_PWM_Out  (DD16.28 R44.1 R61.2 ZQ1.4), Sch_Dr_EEPROM  (DD4.8), Sch_Dr_SBUS  (R71.1), Sch_Dr_LC  (20 pins)
AUX_5V: Sch_Dr_General (XS2.2 XS2.5 XS2.8), Sch_Dr_PWM_Out  (XS15.17)
IN1: Sch_Dr_General (XS7.2), Sch_Dr_PWR5V  (9 pins)
IN2: Sch_Dr_PWR5V  (8 pins), Sch_Dr_AnIn (XS9.1 XS9.2)
LEAK_SIGNAL: Sch_Dr_General (DD1.13), Sch_Dr_LD  (R31.1 VT1.3 XS12.3)
PWM_OE: Sch_Dr_General (DD1.37), Sch_Dr_PWM_Out  (DD16.23 R44.2)
RGB_DIN: Sch_Dr_General (XS2.1), Sch_Dr_NPX  (R42.1)
RGB_LED: Sch_Dr_General (DD1.19), Sch_Dr_NPX  (DA2.2)
RX1: Sch_Dr_General (XS1.3), Sch_Dr_SBUS  (JP1.2), Sch_Dr_LC  (DD6.8)
RX1_RPI: Sch_Dr_General (DD1.10), Sch_Dr_LC  (DD6.5)
RX3: Sch_Dr_General (XS3.3), Sch_Dr_LC  (DD7.8)
RX3_RPI: Sch_Dr_General (DD1.29), Sch_Dr_LC  (DD7.5)
RX4: Sch_Dr_General (XS5.3), Sch_Dr_LC  (DD8.1)
RX4_RPI: Sch_Dr_General (DD1.21), Sch_Dr_LC  (DD8.4)
RX5: Sch_Dr_General (XS8.3), Sch_Dr_LC  (DD9.8)
RX5_RPI: Sch_Dr_General (DD1.33), Sch_Dr_LC  (DD9.5)
SCL0: Sch_Dr_General (DD1.28 R2.1), Sch_Dr_EEPROM  (DD4.6)
SCL1: Sch_Dr_General (DD1.5 R4.2), Sch_Dr_Baro (DD3.4), Sch_Dr_AnIn (DD2.10), Sch_Dr_Mag  (DD15.A2)
SCL4: Sch_Dr_General (DD1.26 R6.2), Sch_Dr_PWM_Out  (DD16.26)
SCL6: Sch_Dr_General (XS4.2 XS6.2 XS8.4), Sch_Dr_LC  (DD10.8)
SCL6_RPI: Sch_Dr_General (DD1.16 R8.2), Sch_Dr_LC  (DD10.5)
SDA0: Sch_Dr_General (DD1.27 R3.1), Sch_Dr_EEPROM  (DD4.5)
SDA1: Sch_Dr_General (DD1.3 R5.2), Sch_Dr_Baro (DD3.3), Sch_Dr_AnIn (DD2.9), Sch_Dr_Mag  (DD15.B2)
SDA4: Sch_Dr_General (DD1.31 R7.2), Sch_Dr_PWM_Out  (DD16.27)
SDA6: Sch_Dr_General (XS4.3 XS6.3 XS8.5), Sch_Dr_LC  (DD10.1)
SDA6_RPI: Sch_Dr_General (DD1.15 R9.2), Sch_Dr_LC  (DD10.4)
SPI1_CS1: Sch_Dr_General (DD1.11), Sch_Dr_Mag  (R33.1 R38.2)
SPI1_CS2: Sch_Dr_General (DD1.36), Sch_Dr_IMU  (DD5.5)
SPI1_MISO: Sch_Dr_General (DD1.35), Sch_Dr_IMU  (DD5.4), Sch_Dr_Mag  (R34.1 R41.2)
SPI1_MOSI: Sch_Dr_General (DD1.38), Sch_Dr_IMU  (DD5.3), Sch_Dr_Mag  (R35.1 R39.2)
SPI1_SCLK: Sch_Dr_General (DD1.40), Sch_Dr_IMU  (DD5.2), Sch_Dr_Mag  (R32.1 R40.2)
TX1: Sch_Dr_General (XS1.2), Sch_Dr_LC  (DD6.1)
TX1_RPI: Sch_Dr_General (DD1.8), Sch_Dr_LC  (DD6.4)
TX3: Sch_Dr_General (XS3.2), Sch_Dr_LC  (DD7.1)
TX3_RPI: Sch_Dr_General (DD1.7), Sch_Dr_LC  (DD7.4)
TX4: Sch_Dr_General (XS5.2), Sch_Dr_LC  (DD8.8)
TX4_RPI: Sch_Dr_General (DD1.24), Sch_Dr_LC  (DD8.5)
TX5: Sch_Dr_General (XS8.2), Sch_Dr_LC  (DD9.1)
TX5_RPI: Sch_Dr_General (DD1.32), Sch_Dr_LC  (DD9.4)